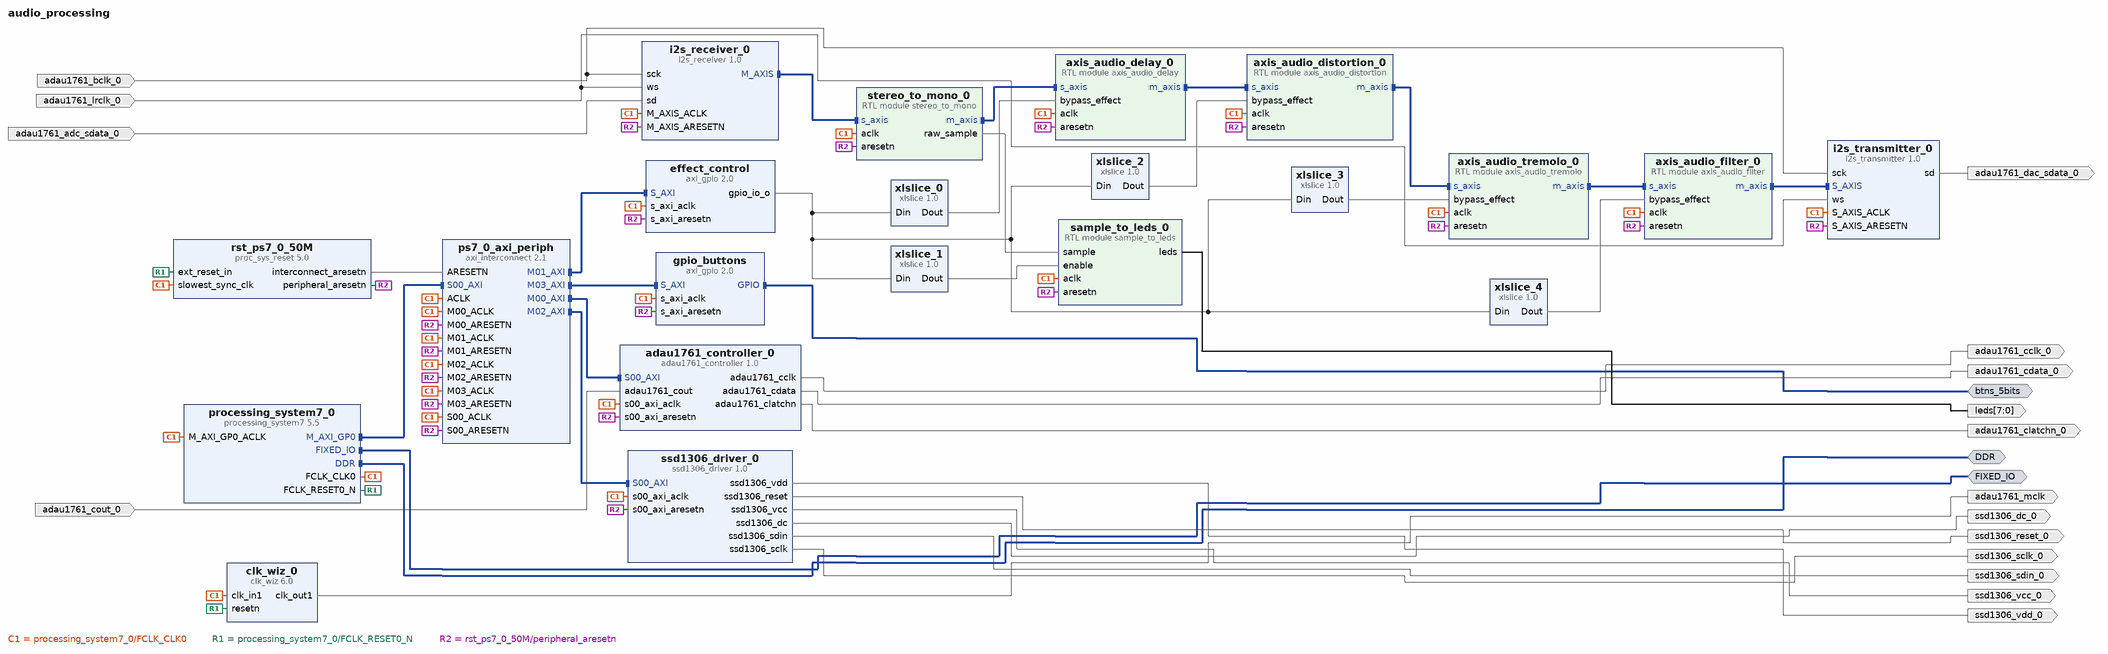
[diagram p0: block diagram of the top level]
# Vivado block design audio_processing, xc7z020clg484-1, Vivado 2018.3
create_bd_design audio_processing

create_bd_intf_port -mode Master -vlnv xilinx.com:interface:ddrx_rtl:1.0 DDR
create_bd_intf_port -mode Master -vlnv xilinx.com:display_processing_system7:fixedio_rtl:1.0 FIXED_IO
create_bd_intf_port -mode Master -vlnv xilinx.com:interface:gpio_rtl:1.0 btns_5bits
create_bd_port -dir I -type data adau1761_adc_sdata_0
create_bd_port -dir I -type data adau1761_bclk_0
create_bd_port -dir O adau1761_cclk_0
create_bd_port -dir O adau1761_cdata_0
create_bd_port -dir O adau1761_clatchn_0
create_bd_port -dir I adau1761_cout_0
create_bd_port -dir O -type data adau1761_dac_sdata_0
create_bd_port -dir I -type data adau1761_lrclk_0
create_bd_port -dir O -type clk adau1761_mclk
create_bd_port -dir O -from 7 -to 0 -type data leds
create_bd_port -dir O ssd1306_vdd_0
create_bd_port -dir O -type rst ssd1306_reset_0
create_bd_port -dir O ssd1306_vcc_0
create_bd_port -dir O ssd1306_dc_0
create_bd_port -dir O ssd1306_sdin_0
create_bd_port -dir O ssd1306_sclk_0

create_bd_cell -type ip -vlnv user.org:user:adau1761_controller:1.0 adau1761_controller_0
create_bd_cell -type ip -vlnv xilinx.com:ip:clk_wiz:6.0 clk_wiz_0
set_property -dict [list \
  CONFIG.CLKIN2_JITTER_PS 166.66 \
  CONFIG.CLKOUT1_DRIVES BUFG \
  CONFIG.CLKOUT1_JITTER 305.592 \
  CONFIG.CLKOUT1_PHASE_ERROR 298.923 \
  CONFIG.CLKOUT1_REQUESTED_OUT_FREQ 24 \
  CONFIG.CLKOUT2_DRIVES BUFG \
  CONFIG.CLKOUT3_DRIVES BUFG \
  CONFIG.CLKOUT4_DRIVES BUFG \
  CONFIG.CLKOUT5_DRIVES BUFG \
  CONFIG.CLKOUT6_DRIVES BUFG \
  CONFIG.CLKOUT7_DRIVES BUFG \
  CONFIG.ENABLE_CLOCK_MONITOR false \
  CONFIG.FEEDBACK_SOURCE FDBK_AUTO \
  CONFIG.MMCM_CLKFBOUT_MULT_F 50.250 \
  CONFIG.MMCM_CLKIN2_PERIOD 10.000 \
  CONFIG.MMCM_CLKOUT0_DIVIDE_F 41.875 \
  CONFIG.MMCM_COMPENSATION ZHOLD \
  CONFIG.MMCM_DIVCLK_DIVIDE 5 \
  CONFIG.PRIMITIVE MMCM \
  CONFIG.RESET_PORT resetn \
  CONFIG.RESET_TYPE ACTIVE_LOW \
  CONFIG.SECONDARY_SOURCE Single_ended_clock_capable_pin \
  CONFIG.USE_INCLK_SWITCHOVER false \
] [get_bd_cells clk_wiz_0]
create_bd_cell -type ip -vlnv user.org:user:i2s_receiver:1.0 i2s_receiver_0
create_bd_cell -type ip -vlnv user.org:user:i2s_transmitter:1.0 i2s_transmitter_0
create_bd_cell -type ip -vlnv xilinx.com:ip:processing_system7:5.5 processing_system7_0
set_property -dict [list \
  CONFIG.PCW_APU_PERIPHERAL_FREQMHZ 666.666667 \
  CONFIG.PCW_ENET0_ENET0_IO {MIO 16 .. 27} \
  CONFIG.PCW_ENET0_GRP_MDIO_ENABLE 1 \
  CONFIG.PCW_ENET0_GRP_MDIO_IO {MIO 52 .. 53} \
  CONFIG.PCW_ENET0_PERIPHERAL_ENABLE 1 \
  CONFIG.PCW_ENET0_RESET_ENABLE 0 \
  CONFIG.PCW_ENET_RESET_ENABLE 1 \
  CONFIG.PCW_ENET_RESET_SELECT {Share reset pin} \
  CONFIG.PCW_FPGA0_PERIPHERAL_FREQMHZ 100.000000 \
  CONFIG.PCW_FPGA1_PERIPHERAL_FREQMHZ 150.000000 \
  CONFIG.PCW_GPIO_MIO_GPIO_ENABLE 1 \
  CONFIG.PCW_GPIO_MIO_GPIO_IO MIO \
  CONFIG.PCW_I2C_RESET_ENABLE 1 \
  CONFIG.PCW_PRESET_BANK1_VOLTAGE {LVCMOS 1.8V} \
  CONFIG.PCW_QSPI_GRP_SINGLE_SS_ENABLE 1 \
  CONFIG.PCW_QSPI_GRP_SINGLE_SS_IO {MIO 1 .. 6} \
  CONFIG.PCW_QSPI_PERIPHERAL_ENABLE 1 \
  CONFIG.PCW_QSPI_QSPI_IO {MIO 1 .. 6} \
  CONFIG.PCW_SD0_GRP_CD_ENABLE 1 \
  CONFIG.PCW_SD0_GRP_CD_IO {MIO 47} \
  CONFIG.PCW_SD0_GRP_WP_ENABLE 1 \
  CONFIG.PCW_SD0_GRP_WP_IO {MIO 46} \
  CONFIG.PCW_SD0_PERIPHERAL_ENABLE 1 \
  CONFIG.PCW_SD0_SD0_IO {MIO 40 .. 45} \
  CONFIG.PCW_SDIO_PERIPHERAL_FREQMHZ 50 \
  CONFIG.PCW_SINGLE_QSPI_DATA_MODE x4 \
  CONFIG.PCW_TTC0_PERIPHERAL_ENABLE 1 \
  CONFIG.PCW_TTC0_TTC0_IO EMIO \
  CONFIG.PCW_UART1_PERIPHERAL_ENABLE 1 \
  CONFIG.PCW_UART1_UART1_IO {MIO 48 .. 49} \
  CONFIG.PCW_UART_PERIPHERAL_FREQMHZ 50 \
  CONFIG.PCW_UIPARAM_DDR_FREQ_MHZ 533.333313 \
  CONFIG.PCW_UIPARAM_DDR_PARTNO {MT41J128M16 HA-15E} \
  CONFIG.PCW_USB0_PERIPHERAL_ENABLE 1 \
  CONFIG.PCW_USB0_RESET_ENABLE 0 \
  CONFIG.PCW_USB0_USB0_IO {MIO 28 .. 39} \
  CONFIG.PCW_USB_RESET_ENABLE 1 \
  CONFIG.PCW_USB_RESET_SELECT {Share reset pin} \
  CONFIG.preset ZedBoard \
] [get_bd_cells processing_system7_0]
# 230 more settings of processing_system7_0 are not shown: defaults, MIO pin electricals, DDR timing, and values the tool derives
create_bd_cell -type ip -vlnv xilinx.com:ip:axi_interconnect:2.1 ps7_0_axi_periph
set_property -dict {CONFIG.NUM_MI 4} [get_bd_cells ps7_0_axi_periph]
create_bd_cell -type ip -vlnv xilinx.com:ip:proc_sys_reset:5.0 rst_ps7_0_50M
create_bd_cell -type ip -vlnv user.org:user:ssd1306_driver:1.0 ssd1306_driver_0
create_bd_cell -type ip -vlnv xilinx.com:ip:axi_gpio:2.0 effect_control
set_property -dict [list \
  CONFIG.C_ALL_OUTPUTS 1 \
  CONFIG.C_GPIO_WIDTH 5 \
  CONFIG.GPIO_BOARD_INTERFACE Custom \
  CONFIG.USE_BOARD_FLOW true \
] [get_bd_cells effect_control]
create_bd_cell -type module -reference axis_audio_delay axis_audio_delay_0
set_property -dict {CONFIG.SIZE_N 16} [get_bd_cells axis_audio_delay_0]
create_bd_cell -type module -reference stereo_to_mono stereo_to_mono_0
create_bd_cell -type ip -vlnv xilinx.com:ip:xlslice:1.0 xlslice_0
set_property -dict {CONFIG.DIN_FROM 1 CONFIG.DIN_TO 1 CONFIG.DIN_WIDTH 5 CONFIG.DOUT_WIDTH 1} [get_bd_cells xlslice_0]
create_bd_cell -type ip -vlnv xilinx.com:ip:xlslice:1.0 xlslice_1
set_property -dict {CONFIG.DIN_FROM 0 CONFIG.DIN_TO 0 CONFIG.DIN_WIDTH 5 CONFIG.DOUT_WIDTH 1} [get_bd_cells xlslice_1]
create_bd_cell -type ip -vlnv xilinx.com:ip:axi_gpio:2.0 gpio_buttons
set_property -dict {CONFIG.GPIO_BOARD_INTERFACE btns_5bits CONFIG.USE_BOARD_FLOW true} [get_bd_cells gpio_buttons]
create_bd_cell -type module -reference sample_to_leds sample_to_leds_0
create_bd_cell -type ip -vlnv xilinx.com:ip:xlslice:1.0 xlslice_2
set_property -dict {CONFIG.DIN_FROM 2 CONFIG.DIN_TO 2 CONFIG.DIN_WIDTH 5 CONFIG.DOUT_WIDTH 1} [get_bd_cells xlslice_2]
create_bd_cell -type ip -vlnv xilinx.com:ip:xlslice:1.0 xlslice_3
set_property -dict {CONFIG.DIN_FROM 3 CONFIG.DIN_TO 3 CONFIG.DIN_WIDTH 5 CONFIG.DOUT_WIDTH 1} [get_bd_cells xlslice_3]
create_bd_cell -type module -reference axis_audio_distortion axis_audio_distortion_0
create_bd_cell -type module -reference axis_audio_tremolo axis_audio_tremolo_0
create_bd_cell -type ip -vlnv xilinx.com:ip:xlslice:1.0 xlslice_4
set_property -dict {CONFIG.DIN_FROM 4 CONFIG.DIN_TO 4 CONFIG.DIN_WIDTH 5 CONFIG.DOUT_WIDTH 1} [get_bd_cells xlslice_4]
create_bd_cell -type module -reference axis_audio_filter axis_audio_filter_0

# ---- connections ----

connect_bd_intf_net [get_bd_intf_ports FIXED_IO] [get_bd_intf_pins processing_system7_0/FIXED_IO]
connect_bd_intf_net [get_bd_intf_pins axis_audio_delay_0/s_axis] [get_bd_intf_pins stereo_to_mono_0/m_axis]
connect_bd_intf_net [get_bd_intf_ports DDR] [get_bd_intf_pins processing_system7_0/DDR]
connect_bd_intf_net [get_bd_intf_pins processing_system7_0/M_AXI_GP0] [get_bd_intf_pins ps7_0_axi_periph/S00_AXI]
connect_bd_intf_net [get_bd_intf_pins axis_audio_distortion_0/s_axis] [get_bd_intf_pins axis_audio_delay_0/m_axis]
connect_bd_intf_net [get_bd_intf_pins stereo_to_mono_0/s_axis] [get_bd_intf_pins i2s_receiver_0/M_AXIS]
connect_bd_intf_net [get_bd_intf_pins ps7_0_axi_periph/M03_AXI] [get_bd_intf_pins gpio_buttons/S_AXI]
connect_bd_intf_net [get_bd_intf_pins ps7_0_axi_periph/M01_AXI] [get_bd_intf_pins effect_control/S_AXI]
connect_bd_intf_net [get_bd_intf_ports btns_5bits] [get_bd_intf_pins gpio_buttons/GPIO]
connect_bd_intf_net [get_bd_intf_pins axis_audio_distortion_0/m_axis] [get_bd_intf_pins axis_audio_tremolo_0/s_axis]
connect_bd_intf_net [get_bd_intf_pins ps7_0_axi_periph/M02_AXI] [get_bd_intf_pins ssd1306_driver_0/S00_AXI]
connect_bd_intf_net [get_bd_intf_pins adau1761_controller_0/S00_AXI] [get_bd_intf_pins ps7_0_axi_periph/M00_AXI]
connect_bd_intf_net [get_bd_intf_pins axis_audio_filter_0/m_axis] [get_bd_intf_pins i2s_transmitter_0/S_AXIS]
connect_bd_intf_net [get_bd_intf_pins axis_audio_filter_0/s_axis] [get_bd_intf_pins axis_audio_tremolo_0/m_axis]
connect_bd_net [get_bd_ports adau1761_bclk_0] [get_bd_pins i2s_receiver_0/sck] [get_bd_pins i2s_transmitter_0/sck]
connect_bd_net [get_bd_ports adau1761_lrclk_0] [get_bd_pins i2s_receiver_0/ws] [get_bd_pins i2s_transmitter_0/ws]
connect_bd_net -net adau1761_adc_sdata_0_1 [get_bd_ports adau1761_adc_sdata_0] [get_bd_pins i2s_receiver_0/sd]
connect_bd_net [get_bd_pins adau1761_controller_0/adau1761_cclk] [get_bd_ports adau1761_cclk_0]
connect_bd_net [get_bd_pins adau1761_controller_0/adau1761_cdata] [get_bd_ports adau1761_cdata_0]
connect_bd_net [get_bd_pins adau1761_controller_0/adau1761_clatchn] [get_bd_ports adau1761_clatchn_0]
connect_bd_net -net adau1761_cout_0_1 [get_bd_ports adau1761_cout_0] [get_bd_pins adau1761_controller_0/adau1761_cout]
connect_bd_net [get_bd_pins clk_wiz_0/clk_out1] [get_bd_ports adau1761_mclk]
connect_bd_net [get_bd_pins i2s_transmitter_0/sd] [get_bd_ports adau1761_dac_sdata_0]
connect_bd_net [get_bd_pins processing_system7_0/FCLK_CLK0] \
  [get_bd_pins adau1761_controller_0/s00_axi_aclk] [get_bd_pins clk_wiz_0/clk_in1] [get_bd_pins i2s_receiver_0/M_AXIS_ACLK] \
  [get_bd_pins i2s_transmitter_0/S_AXIS_ACLK] [get_bd_pins processing_system7_0/M_AXI_GP0_ACLK] \
  [get_bd_pins ps7_0_axi_periph/ACLK] [get_bd_pins ps7_0_axi_periph/M00_ACLK] [get_bd_pins ps7_0_axi_periph/S00_ACLK] \
  [get_bd_pins rst_ps7_0_50M/slowest_sync_clk] [get_bd_pins ps7_0_axi_periph/M01_ACLK] \
  [get_bd_pins ps7_0_axi_periph/M02_ACLK] [get_bd_pins ssd1306_driver_0/s00_axi_aclk] [get_bd_pins effect_control/s_axi_aclk] \
  [get_bd_pins axis_audio_delay_0/aclk] [get_bd_pins stereo_to_mono_0/aclk] [get_bd_pins gpio_buttons/s_axi_aclk] \
  [get_bd_pins ps7_0_axi_periph/M03_ACLK] [get_bd_pins sample_to_leds_0/aclk] [get_bd_pins axis_audio_distortion_0/aclk] \
  [get_bd_pins axis_audio_tremolo_0/aclk] [get_bd_pins axis_audio_filter_0/aclk]
connect_bd_net [get_bd_pins processing_system7_0/FCLK_RESET0_N] [get_bd_pins clk_wiz_0/resetn] [get_bd_pins rst_ps7_0_50M/ext_reset_in]
connect_bd_net [get_bd_pins rst_ps7_0_50M/interconnect_aresetn] [get_bd_pins ps7_0_axi_periph/ARESETN]
connect_bd_net [get_bd_pins rst_ps7_0_50M/peripheral_aresetn] \
  [get_bd_pins adau1761_controller_0/s00_axi_aresetn] [get_bd_pins i2s_receiver_0/M_AXIS_ARESETN] \
  [get_bd_pins i2s_transmitter_0/S_AXIS_ARESETN] [get_bd_pins ps7_0_axi_periph/M00_ARESETN] \
  [get_bd_pins ps7_0_axi_periph/S00_ARESETN] [get_bd_pins ps7_0_axi_periph/M01_ARESETN] \
  [get_bd_pins ps7_0_axi_periph/M02_ARESETN] [get_bd_pins ssd1306_driver_0/s00_axi_aresetn] \
  [get_bd_pins effect_control/s_axi_aresetn] [get_bd_pins axis_audio_delay_0/aresetn] [get_bd_pins stereo_to_mono_0/aresetn] \
  [get_bd_pins gpio_buttons/s_axi_aresetn] [get_bd_pins ps7_0_axi_periph/M03_ARESETN] [get_bd_pins sample_to_leds_0/aresetn] \
  [get_bd_pins axis_audio_distortion_0/aresetn] [get_bd_pins axis_audio_tremolo_0/aresetn] \
  [get_bd_pins axis_audio_filter_0/aresetn]
connect_bd_net [get_bd_pins sample_to_leds_0/leds] [get_bd_ports leds]
connect_bd_net [get_bd_pins stereo_to_mono_0/raw_sample] [get_bd_pins sample_to_leds_0/sample]
connect_bd_net [get_bd_pins ssd1306_driver_0/ssd1306_vdd] [get_bd_ports ssd1306_vdd_0]
connect_bd_net [get_bd_pins ssd1306_driver_0/ssd1306_reset] [get_bd_ports ssd1306_reset_0]
connect_bd_net [get_bd_pins ssd1306_driver_0/ssd1306_vcc] [get_bd_ports ssd1306_vcc_0]
connect_bd_net [get_bd_pins ssd1306_driver_0/ssd1306_dc] [get_bd_ports ssd1306_dc_0]
connect_bd_net [get_bd_pins ssd1306_driver_0/ssd1306_sdin] [get_bd_ports ssd1306_sdin_0]
connect_bd_net [get_bd_pins ssd1306_driver_0/ssd1306_sclk] [get_bd_ports ssd1306_sclk_0]
connect_bd_net [get_bd_pins effect_control/gpio_io_o] \
  [get_bd_pins xlslice_0/Din] [get_bd_pins xlslice_1/Din] [get_bd_pins xlslice_2/Din] [get_bd_pins xlslice_3/Din] \
  [get_bd_pins xlslice_4/Din]
connect_bd_net [get_bd_pins xlslice_0/Dout] [get_bd_pins axis_audio_delay_0/bypass_effect]
connect_bd_net [get_bd_pins xlslice_1/Dout] [get_bd_pins sample_to_leds_0/enable]
connect_bd_net [get_bd_pins xlslice_2/Dout] [get_bd_pins axis_audio_distortion_0/bypass_effect]
connect_bd_net [get_bd_pins xlslice_3/Dout] [get_bd_pins axis_audio_tremolo_0/bypass_effect]
connect_bd_net [get_bd_pins xlslice_4/Dout] [get_bd_pins axis_audio_filter_0/bypass_effect]

# ---- address map ----
assign_bd_address -offset 0x41200000 -range 64K -target_address_space [get_bd_addr_spaces processing_system7_0/Data] [get_bd_addr_segs effect_control/S_AXI/Reg]
assign_bd_address -offset 0x41210000 -range 64K -target_address_space [get_bd_addr_spaces processing_system7_0/Data] [get_bd_addr_segs gpio_buttons/S_AXI/Reg]
assign_bd_address -offset 0x43C00000 -range 64K -target_address_space [get_bd_addr_spaces processing_system7_0/Data] [get_bd_addr_segs adau1761_controller_0/S00_AXI/S00_AXI_reg]
assign_bd_address -offset 0x43C20000 -range 64K -target_address_space [get_bd_addr_spaces processing_system7_0/Data] [get_bd_addr_segs ssd1306_driver_0/S00_AXI/S00_AXI_reg]

validate_bd_design
save_bd_design
